# Altium schematic sheet TFTLCD.SchDoc
size A3; SheetNumber: 7; SheetTotal: 8
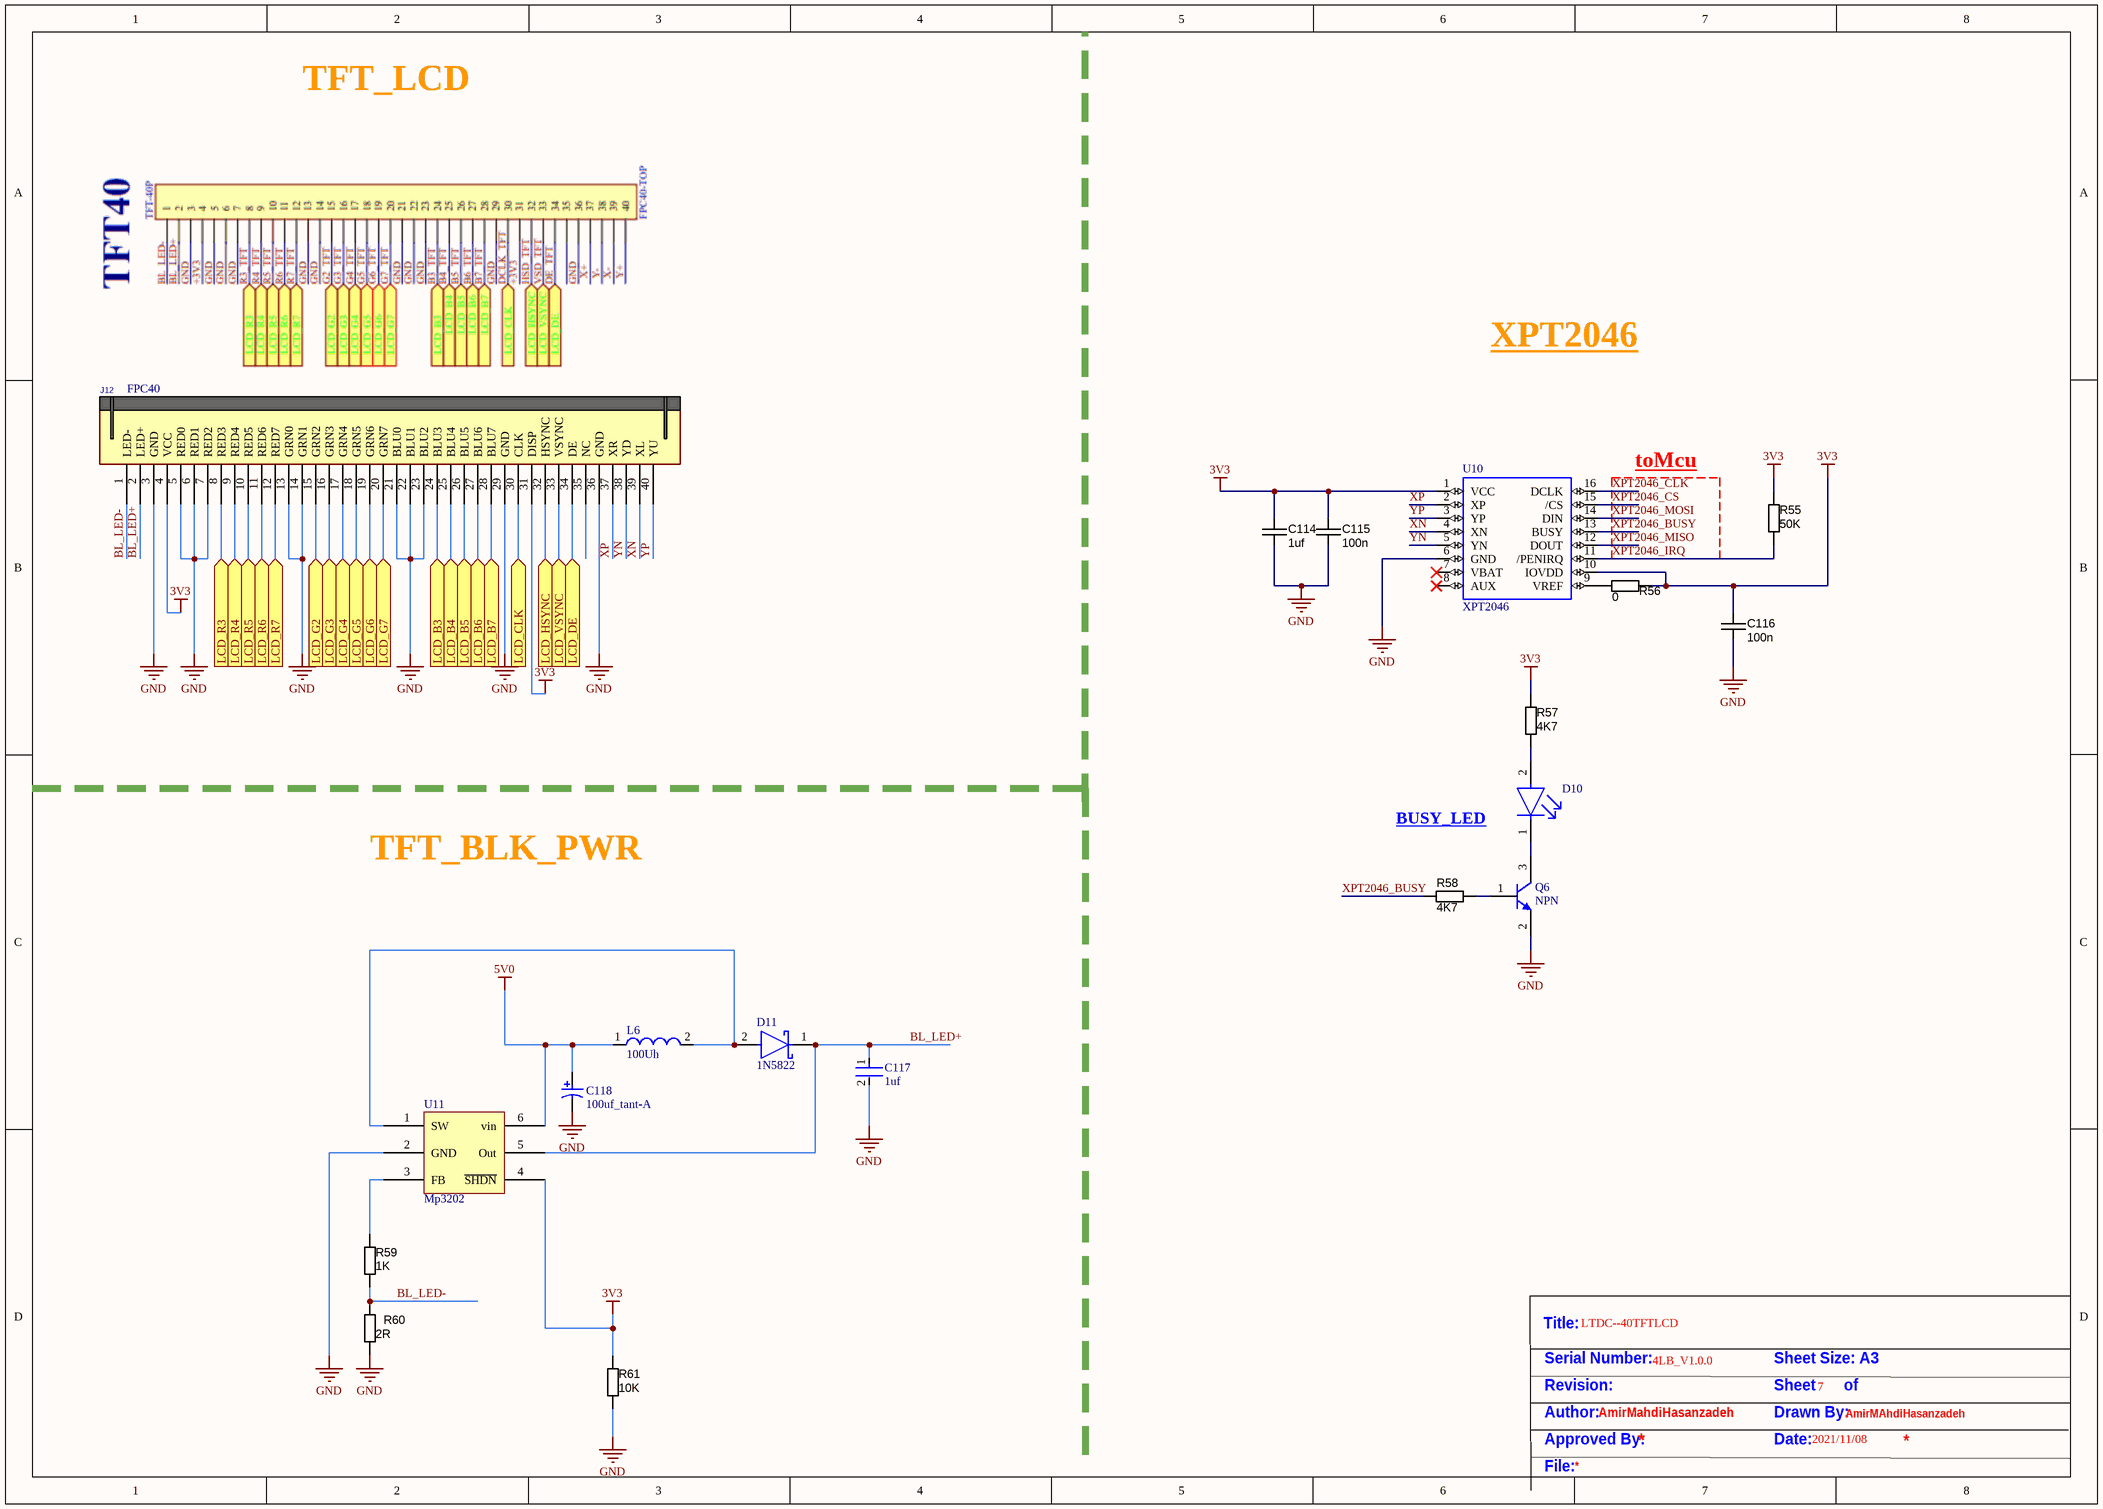
[diagram p0: TFTLCD.SchDoc]

## Parts
C114  1uf  [CAPC3216X180N]
C115  value 100n  [CAPC1608X90N]  (hidden comment: approved sub OK)
C116  value 100n  [CAPC1608X90N]  (hidden comment: approved sub OK)
C117  1uf  [FP-GRM31C-0_2-e0_3_0_8-MFG]
C118  100uf_tant-A  [AVX-TPSA106K010R1800_M]
D10  LTST-C191TBKT  [FP-LTST-C191TBKT-MFG]  (value not drawn)
D11  1N5822  [FP-DO-201AD-MFG]
J12  FPC40  [FPC50_40]
L6  100Uh  [WE-PD2-M]
Q6  NPN  [SOT23-3]
R55  value 50K  [RESC1608X55N]  (hidden comment: Thick Film)
R56  value 0  [RESC1608X55N]  (hidden comment: Thick Film)
R57  value 4K7  [RESC1608X55N]  (hidden comment: Thick Film)
R58  value 4K7  [RESC1608X55N]  (hidden comment: Thick Film)
R59  value 1K  [RESC1608X55N]  (hidden comment: Thick Film)
R60  value 2R  [RESC1608X55N]  (hidden comment: Thick Film)
R61  value 10K  [RESC1608X55N]  (hidden comment: Thick Film)
U10  XPT2046  [TSSOP-16]
U11  Mp3202  [SOT95P280X145-6N]

## Ports
LCD_B3 (in), LCD_B4 (in), LCD_B5 (in), LCD_B6 (in), LCD_B7 (in), LCD_CLK (in), LCD_DE (in), LCD_G2 (in), LCD_G3 (in), LCD_G4 (in), LCD_G5 (in), LCD_G6 (in), LCD_G7 (in), LCD_HSYNC (in), LCD_R3 (in), LCD_R4 (in), LCD_R5 (in), LCD_R6 (in), LCD_R7 (in), LCD_VSYNC (in)

## Nets
3V3: C114.1 C115.1 C116.1 J12.4(VCC) J12.31(DISP) R55.1 R56.1 R57.2 R61.2 U10.1(VCC) U10.10(IOVDD) U11.4(~{SHDN})
5V0: C118.1 L6.1 U11.6(vin)
GND: C114.2 C115.2 C116.2 C117.2 C118.2 J12.3(GND) J12.5(RED0) J12.6(RED1) J12.7(RED2) J12.13(GRN0) J12.14(GRN1) J12.21(BLU0) J12.22(BLU1) J12.23(BLU2) J12.29(GND) J12.36(GND) Q6.2(E) R60.1 R61.1 U10.6(GND) U11.2(GND)
BL_LED+: C117.1 D11.1(C) J12.2(LED+) U11.5(Out)
BL_LED-: J12.1(LED-) R59.2 R60.2
LCD_B3: J12.24(BLU3) ; port LCD_B3
LCD_B4: J12.25(BLU4) ; port LCD_B4
LCD_B5: J12.26(BLU5) ; port LCD_B5
LCD_B6: J12.27(BLU6) ; port LCD_B6
LCD_B7: J12.28(BLU7) ; port LCD_B7
LCD_CLK: J12.30(CLK) ; port LCD_CLK
LCD_DE: J12.34(DE) ; port LCD_DE
LCD_G2: J12.15(GRN2) ; port LCD_G2
LCD_G3: J12.16(GRN3) ; port LCD_G3
LCD_G4: J12.17(GRN4) ; port LCD_G4
LCD_G5: J12.18(GRN5) ; port LCD_G5
LCD_G6: J12.19(GRN6) ; port LCD_G6
LCD_G7: J12.20(GRN7) ; port LCD_G7
LCD_HSYNC: J12.32(HSYNC) ; port LCD_HSYNC
LCD_R3: J12.8(RED3) ; port LCD_R3
LCD_R4: J12.9(RED4) ; port LCD_R4
LCD_R5: J12.10(RED5) ; port LCD_R5
LCD_R6: J12.11(RED6) ; port LCD_R6
LCD_R7: J12.12(RED7) ; port LCD_R7
LCD_VSYNC: J12.33(VSYNC) ; port LCD_VSYNC
XN: J12.39(XL) U10.4(XN)
XP: J12.37(XR) U10.2(XP)
XPT2046_BUSY: R58.1 U10.13(BUSY)
XPT2046_CLK: U10.16(DCLK)
XPT2046_CS: U10.15(/CS)
XPT2046_IRQ: R55.2 U10.11(/PENIRQ)
XPT2046_MISO: U10.12(DOUT)
XPT2046_MOSI: U10.14(DIN)
YN: J12.38(YD) U10.5(YN)
YP: J12.40(YU) U10.3(YP)
NetD10_1: D10.1(C) Q6.3(C)
NetD10_2: D10.2(A) R57.1
NetD11_2: D11.2(A) L6.2 U11.1(SW)
NetQ6_1: Q6.1(B) R58.2
NetR56_2: R56.2 U10.9(VREF)
NetR59_1: R59.1 U11.3(FB)

Not connected (* = marked no-connect by the designer): J12 35(NC); U10 7(VBAT)* 8(AUX)*

## Notes on the sheet
- TFT_LCD
- XPT2046
- toMcu
- BUSY_LED
- TFT_BLK_PWR
- Title:
- LTDC--40TFTLCD
- Serial Number:
- Revision:
- 4LB_V1.0.0
- Sheet       of
- Sheet Size: A3
- 7
- Author:
- Approved By:
- AmirMahdiHasanzadeh
- Date:
- Drawn By:
- 2021/11/08
- AmirMAhdiHasanzadeh
- File:

## Library data of the parts
C114 = CAPC_47n_1206_X7R_50V_10%: Capacitor SMD Cer 47nF 10% 50V X7R 1206; Manufacturer 1: Yageo; Manufacturer Part Number 1: CC1206KRX7R9BB473; Ratings: 50V; X7R; SCDType: spec; Package / Case: 1206 (3216 Metric); Tolerance: ±10%; Operating Temperature: -55°C ~ 125°C; Size / Dimension: 0.126" L x 0.063" W (3.20mm x 1.60mm); Supplier 1: Digi-Key; Voltage - Rated: 50V; Supplier Part Number 1: 311-1178-1-ND; Value: 1uf
C115 C116 = CAPC_100n_0603_X7R_50V_10%: Capacitor SMD Cer 100nF 10% 50V X7R 0603; Manufacturer 1: AVX Corporation; Manufacturer Part Number 1: 06035C104KAT2A; Ratings: 50V; X7R; Material: ceramic; SCDType: spec; Manufacturer 2: TDK Corporation; Manufacturer Part Number 2: C1608X7R1H104K; Package / Case: 0603 (1608 Metric); Tolerance: ±10%; Supplier 1: Digi-Key; Supplier Part Number 1: 478-5052-1-ND; ComponentLink1URL: http://www.avx.com/docs/Catalogs/cx7r.pdf; ComponentLink1Description: http://www.avx.com/docs/Catalogs/cx7r.pdf; Supplier 2: Digi-Key; Supplier Part Number 2: 445-1314-1-ND; ComponentLink2URL: http://product.tdk.com/capacitor/mlcc/en/documents/mlcc_commercial_general_en.pdf; ComponentLink2Description: http://product.tdk.com/capacitor/mlcc/en/documents/mlcc_commercial_general_en.pdf
C117 = CMP-06035-003841-1: Chip Multilayer Ceramic Capacitors for General Purpose, 1206, 22uF, X7R, 15%, 10%, 10V; Height: 1.6mm; Width: 0.063inch; Min Operating Temperature: -55°C; Package Quantity: 1; Termination: SMD/SMT; Length: 3.2mm; Voltage Rating: 10V; Case/Package: 1206; Capacitance: 22uF; Case Code (Imperial): 1206; Depth: 1.6mm; Dielectric: X7R; Voltage: 10V; Material: Ceramic; Tolerance: 10%; Voltage Rating (DC): 10V; Lead Free: Lead Free; Max Operating Temperature: 125°C; Case Code (Metric): 3216; Packaging: Tape and Reel; Thickness: 0.071inch; Radiation Hardening: No; REACH SVHC: No SVHC; Mount: Surface Mount
C118 = CMP-2000-07288-1: Tantalum Capacitor, 22uF, +/- 10%, 10 V, -55 to 125 degC, 2-Pin Molded, RoHS, Tape and Reel; Manufacturer: AVX; Manufacturer Size Code: A; Online Catalog: TPSSeries; Other Names: 478-3317-1; Kits: 478-3444-ND-KITTANTCAPTPSSERIES; ESR (Equivalent Series Resistance): 1.8Ohm; Catalog Drawings: TPSSeriesSides; Product Training Modules: ComponentSolutionsforSmartMeterApplications; Voltage - Rated: 10V; EDA / CAD Models: DownloadfromAcceleratedDesigns; Featured Product: TPSCapacitors; Capacitance: 10µF; Mounting Type: SurfaceMount; Packaging: CutTape(CT); Package Reference: TPSA106K010R1800; Size / Dimension: 0.126"Lx0.063"W(3.20mmx1.60mm); Package / Case: 1206(3216Metric); Mounting Technology: SurfaceMount; Family: TantalumCapacitors; Manufacturer URL: http://www.avx.com/; Datasheet URL: http://www.farnell.com/datasheets/1441576.pdf; Datasheet Version: 03/2011; Height - Seated (Max): 0.071"(1.80mm); Type: Molded; Features: GeneralPurpose; Lifetime @ Temp.: -; Lead Spacing: -; Standard Package: 1; Package Description: 2-Pin Surface Mount Device, Body 3.2 x 1.65 mm; Tolerance: ±10%; Category: Capacitors; Operating Temperature: -55°C~125°C; Series: TPS
D10 = CMP-22017-000008-1: LED BLUE CLEAR CHIP SMD; Lens Color: Colorless; Dominant Wavelength: 475nm; Forward Current: 20mA; Wavelength: 468nm; Viewing Angle: 130°; Power Dissipation: 76mW; Luminous Intensity: 180mcd; Reverse Voltage: 5V; Number of Elements: 1; Lens Style: Diffused; Forward Voltage: 3.8V; Max Power Dissipation: 75mW; Case Code (Metric): 1608; Packaging: Tape and Reel; Case/Package: 0603; Depth: 1.6mm; Mount: Surface Mount; Lead Free: Lead Free; Min Operating Temperature: -20°C; Lens Transparency: Clear; Illumination Color: Blue; Height: 0.55mm; Test Current: 20mA; Case Code (Imperial): 0603; Max Operating Temperature: 80°C; Number of Pins: 2; Length: 0.8mm; Radiation Hardening: No; Package Quantity: 1; Number of LEDs: 1; Width: 0.8mm; Color: Blue
D11 = CMP-12187-000025-1: DIODE SCHOTTKY 40V 3A DO201AD; Manufacturer: STMicroelectronics; Max Junction Temp: +150°C; Peak Reverse Current: 2mA; Max Surge Forward Current: 80A; Temperature Range High: +150°C; Automotive: No; RoHS: TRUE; ComponentLink2Description: Datasheet; Manufacturer Part Number: 1N5822; Lead Free: Yes; Octopart: https://octopart.com/1n5822-stmicroelectronics-323225; Device Class L2: Diodes; Max Repetitive Reverse Voltage: 40V; Temperature: to +150°C; Height: 5.3mm; Category: Diode; Digikey Description: DIODE SCHOTTKY 40V 3A DO201AD; ComponentLink2URL: https://www.st.com/resource/en/datasheet/1n5822.pdf; Device Class L3: Schottky Diodes; Device Class L1: Discrete Semiconductors; Forward Current: 3A; Mouser Description: Schottky Diodes & Rectifiers Vr/40V Io/3A BULK; Package: DO-201AD
J12 = FPC50_40: CONN, FPC, 0.50mm pitch, RightAngle, Bot. Contact; DESC: FH12F-40S-0.5SH, FH12S-40S-0.5SH; MANF: MOLEX, Hirose; MANF_P#: 54132‐4062, FH12-40S-0.5SH; VALUE: FPC40
L6 = CMP-0227-00441-1: SMD Power Inductor WE-PD2, L = 100 µH; Inductance: 100 ÂµH; ComponentLink2Description: Datasheet; ComponentLink1URL: http://www.we-online.com; DatasheetVersion: ver 2, Jun-2005; ComponentLink2URL: http://www.we-online.de/katalog/media/pdf/74477420.pdf; PackageDescription: SMD Inductor, 2-Leads, Body 5.8 x 5.2 mm; PackageVersion: 2005; ComponentLink1Description: Manufacturer Link; PackageReference: WE-PD2-M
Q6 = NPN: NPN Bipolar Transistor; Published: 8-Jun-2000; LatestRevisionDate: 17-Jul-2002; LatestRevisionNote: Re-released for DXP Platform.; PackageReference: TO-226-AA; Publisher: Altium Limited; PackageDescription: TO, Flat Index; 3 In-Line, Axial Leads; Body Dia. 4.8mm; Leads 0.55 x 0.51 mm (max); Code_JEDEC: TO-226-AA
R55 = RES_4K7_0603_5%: Resistor SMD chip 10K Ohm 0.1W 5% 0603; Manufacturer 1: Vishay/Dale; Manufacturer Part Number 1: CRCW06034K70JNEA; Ratings: 1/10 W; SCDType: spec; Package / Case: 0603 (1608 metric); Tolerance: ±5%; Material: Thick Film; Supplier 1: Digi-Key; Supplier Part Number 1: 541-4.7KGCT-ND
R56 = RES_4K7_0603_5%: Resistor SMD chip 0 Ohm 0.1W 5% 0603; Manufacturer 1: Vishay/Dale; Manufacturer Part Number 1: CRCW06034K70JNEA; Ratings: 1/10 W; SCDType: spec; Package / Case: 0603 (1608 metric); Tolerance: ±5%; Material: Thick Film; Supplier 1: Digi-Key; Supplier Part Number 1: 541-4.7KGCT-ND
R57-R61 = RES_4K7_0603_5%: Resistor SMD chip 4.7k Ohm 0.1W 5% 0603; Manufacturer 1: Vishay/Dale; Manufacturer Part Number 1: CRCW06034K70JNEA; Ratings: 1/10 W; SCDType: spec; Package / Case: 0603 (1608 metric); Tolerance: ±5%; Material: Thick Film; Supplier 1: Digi-Key; Supplier Part Number 1: 541-4.7KGCT-ND
U10 = XPT2046: RASPBERRY PI 3.5 TFT DISPLAY; MF: Xptek; Value: *; Package: Package; Availability: Unavailable; SnapEDA_Link: https://www.snapeda.com/parts/XPT2046/Xptek/view-part/5164510/?ref=snap; MP: XPT2046; Price: None; Check_prices: https://www.snapeda.com/parts/XPT2046/Xptek/view-part/5164510/?ref=eda